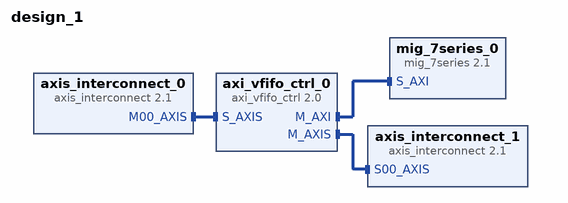
[diagram p0: block diagram of the top level]
# Vivado block design design_1, Vivado 2014.2
create_bd_design design_1

create_bd_cell -type ip -vlnv xilinx.com:ip:axis_interconnect:2.1 axis_interconnect_0
set_property -dict [list \
  CONFIG.NUM_SI 2 \
  CONFIG.NUM_MI 1 \
  CONFIG.S00_FIFO_DEPTH 64 \
  CONFIG.S01_FIFO_DEPTH 64 \
  CONFIG.S00_FIFO_MODE 0 \
  CONFIG.S01_FIFO_MODE 1 \
] [get_bd_cells axis_interconnect_0]
create_bd_cell -type ip -vlnv xilinx.com:ip:axis_interconnect:2.1 axis_interconnect_1
set_property -dict [list \
  CONFIG.ENABLE_ADVANCED_OPTIONS 0 \
  CONFIG.M00_FIFO_DEPTH 64 \
  CONFIG.M01_FIFO_DEPTH 64 \
  CONFIG.M01_FIFO_MODE 1 \
] [get_bd_cells axis_interconnect_1]
create_bd_cell -type ip -vlnv xilinx.com:ip:axi_vfifo_ctrl:2.0 axi_vfifo_ctrl_0
set_property -dict [list \
  CONFIG.axis_tdata_width 64 \
  CONFIG.number_of_page_ch0 4096 \
  CONFIG.number_of_page_ch1 4096 \
] [get_bd_cells axi_vfifo_ctrl_0]
create_bd_cell -type ip -vlnv xilinx.com:ip:mig_7series:2.1 mig_7series_0
set_property -dict [list \
  CONFIG.XML_INPUT_FILE mig_a.prj \
  CONFIG.RESET_BOARD_INTERFACE Custom \
  CONFIG.MIG_DONT_TOUCH_PARAM Custom \
  CONFIG.BOARD_MIG_PARAM Custom \
] [get_bd_cells mig_7series_0]

# ---- connections ----

connect_bd_intf_net [get_bd_intf_pins axis_interconnect_0/M00_AXIS] [get_bd_intf_pins axi_vfifo_ctrl_0/S_AXIS]
connect_bd_intf_net [get_bd_intf_pins axis_interconnect_1/S00_AXIS] [get_bd_intf_pins axi_vfifo_ctrl_0/M_AXIS]
connect_bd_intf_net [get_bd_intf_pins axi_vfifo_ctrl_0/M_AXI] [get_bd_intf_pins mig_7series_0/S_AXI]

validate_bd_design
save_bd_design
